# EAGLE design decoder (EAGLE 7.2.0)
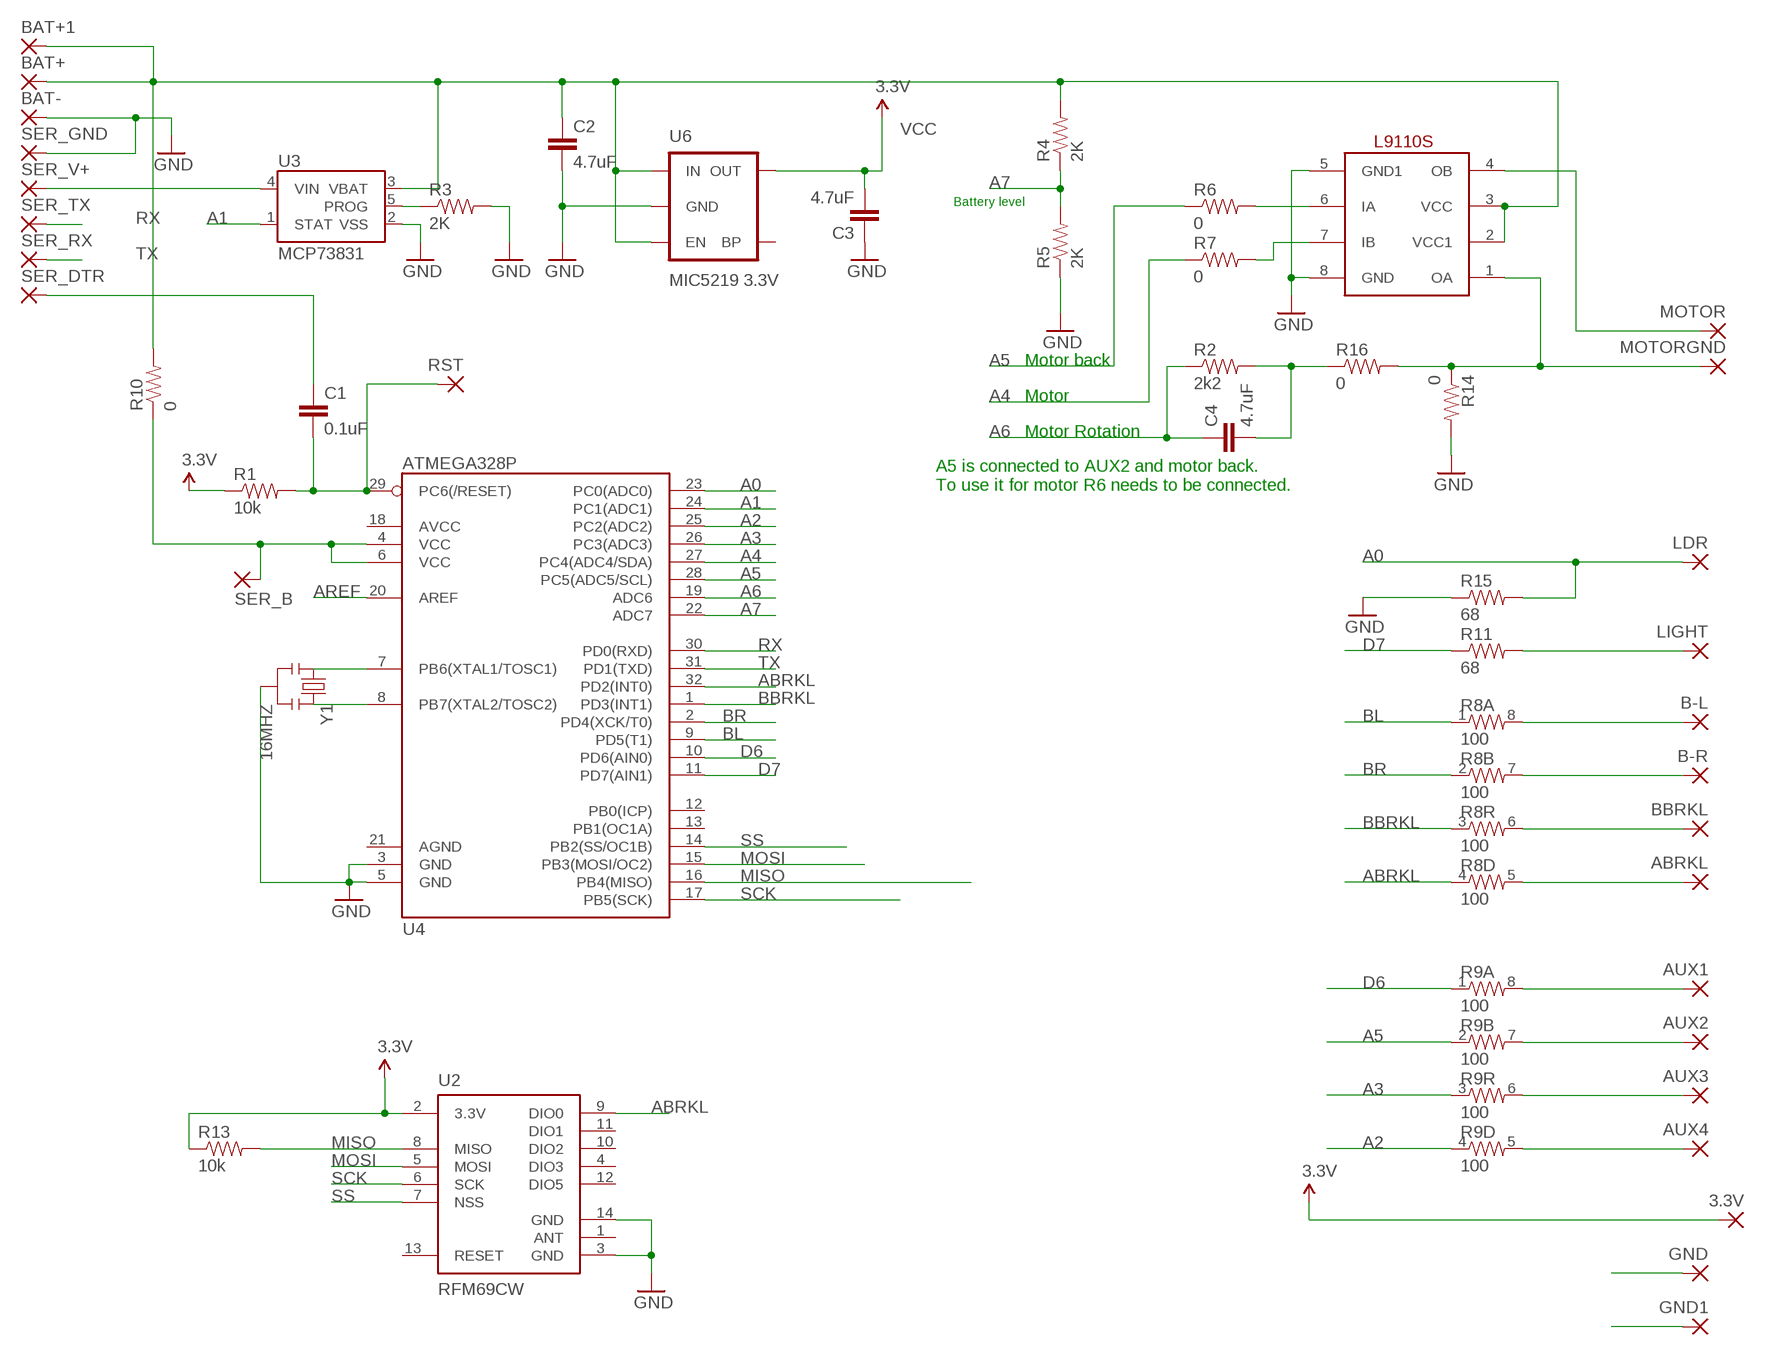
[diagram p0: schematic, sheet 1]

## Parts
3.3V  SMD2  [SMD1,27-2,54]
ABRKL  SMD2  [SMD1,27-2,54]
AUX1  SMD2  [SMD1,27-2,54]
AUX2  SMD2  [SMD1,27-2,54]
AUX3  SMD2  [SMD1,27-2,54]
AUX4  SMD2  [SMD1,27-2,54]
B-L  SMD2  [SMD1,27-2,54]
B-R  SMD2  [SMD1,27-2,54]
BAT+  SMD2  [SMD1,27-2,54]
BAT+1  SMD2  [SMD1,27-2,54]
BAT-  SMD2  [SMD1,27-2,54]
BBRKL  SMD2  [SMD1,27-2,54]
C1  0.1uF  CAP0805  [0805]
C2  4.7uF  CAP0805  [0805]
C3  4.7uF  CAP0805  [0805]
C4  4.7uF  CAP0805  [0805]
GND  SMD2  [SMD1,27-2,54]
GND1  SMD2  [SMD1,27-2,54]
LDR  SMD2  [SMD1,27-2,54]
LIGHT  SMD2  [SMD1,27-2,54]
MDRIVER  L9110S  [SO08]
MOTOR  SMD2  [SMD1,27-2,54]
MOTORGND  SMD2  [SMD1,27-2,54]
R1  10k  RESISTOR0603-RES  [0603-RES]
R2  2k2  RESISTOR0603-RES  [0603-RES]
R3  2K  RESISTOR0603-RES  [0603-RES]
R4  2K  RESISTOR0603-RES  [0603-RES]
R5  2K  RESISTOR0603-RES  [0603-RES]
R6  0  RESISTOR0603-RES  [0603-RES]
R7  0  RESISTOR0603-RES  [0603-RES]
R8  100  RESISTOR-ARRAY0603-ARV  [0603-ARV]
R9  100  RESISTOR-ARRAY0603-ARV  [0603-ARV]
R10  0  RESISTOR0603-RES  [0603-RES]
R11  68  RESISTOR0603-RES  [0603-RES]
R13  10k  RESISTOR0603-RES  [0603-RES]
R14  0  RESISTOR0603-RES  [0603-RES]
R15  68  RESISTOR0603-RES  [0603-RES]
R16  0  RESISTOR0603-RES  [0603-RES]
RST  SMD2  [SMD1,27-2,54]
SER_B  SMD2  [SMD1,27-2,54]
SER_DTR  SMD2  [SMD1,27-2,54]
SER_GND  SMD2  [SMD1,27-2,54]
SER_RX  SMD2  [SMD1,27-2,54]
SER_TX  SMD2  [SMD1,27-2,54]
SER_V+  SMD2  [SMD1,27-2,54]
U2  RFM69CW  [RFM69CW-XXXS2]
U3  MCP73831  [SOT23-5]
U4  ATMEGA328P  ATMEGA328_SMT  [TQFP32-08]
U6  MIC5219 3.3V  V_REG_MIC52193.3V  [SOT23-5]
Y1  16MHZ  RESONATOR16MHZ  [RESONATOR-SMD]

## Nets
A0: LDR.1(P) R15.2 U4.23(PC0(ADC0))
A1: U3.1(STAT) U4.24(PC1(ADC1))
A2: R9.4 U4.25(PC2(ADC2))
A3: R9.3 U4.26(PC3(ADC3))
A4: R7.1 U4.27(PC4(ADC4/SDA))
A5: R6.1 R9.2 U4.28(PC5(ADC5/SCL))
A6: C4.1 R2.1 U4.19(ADC6)
A7: R4.1 R5.2 U4.22(ADC7)
ABRKL: R8.4 U2.9(DIO0) U4.32(PD2(INT0))
AREF: U4.20(AREF)
BAT+: BAT+1.1(P) BAT+.1(P) C2.1 MDRIVER.2(VCC1) MDRIVER.3(VCC) R4.2 R10.2 U3.3(VBAT) U6.1(IN) U6.3(EN)
BBRKL: R8.3 U4.1(PD3(INT1))
BL: R8.1 U4.9(PD5(T1))
BR: R8.2 U4.2(PD4(XCK/T0))
D6: R9.1 U4.10(PD6(AIN0))
D7: R11.1 U4.11(PD7(AIN1))
GND: BAT-.1(P) C2.2 C3.1 GND1.1(P) GND.1(P) MDRIVER.5(GND1) MDRIVER.8(GND) R3.2 R5.1 R14.2 R15.1 SER_GND.1(P) U2.3(GND) U2.14(GND) U3.2(VSS) U4.3(GND) U4.5(GND) U6.2(GND) Y1.2
MISO: R13.2 U2.8(MISO) U4.16(PB4(MISO))
MOSI: U2.5(MOSI) U4.15(PB3(MOSI/OC2))
N$1: C4.2 R2.2 R16.1
N$2: U4.7(PB6(XTAL1/TOSC1)) Y1.1
N$3: C1.1 SER_DTR.1(P)
N$4: U4.8(PB7(XTAL2/TOSC2)) Y1.3
N$5: C1.2 R1.2 RST.1(P) U4.29(PC6(/RESET))
N$6: MDRIVER.6(IA) R6.2
N$7: MDRIVER.7(IB) R7.2
N$8: R10.1 SER_B.1(P) U4.4(VCC) U4.6(VCC)
N$9: SER_V+.1(P) U3.4(VIN)
N$11: R3.1 U3.5(PROG)
N$12: LIGHT.1(P) R11.2
N$13: B-L.1(P) R8.8
N$16: B-R.1(P) R8.7
N$18: BBRKL.1(P) R8.6
N$20: ABRKL.1(P) R8.5
N$21: AUX1.1(P) R9.8
N$22: AUX2.1(P) R9.7
N$23: AUX3.1(P) R9.6
N$24: AUX4.1(P) R9.5
OA: MDRIVER.1(OA) MOTORGND.1(P) R14.1 R16.2
OB: MDRIVER.4(OB) MOTOR.1(P)
RX: SER_TX.1(P) U4.30(PD0(RXD))
SCK: U2.6(SCK) U4.17(PB5(SCK))
SS: U2.7(NSS) U4.14(PB2(SS/OC1B))
TX: SER_RX.1(P) U4.31(PD1(TXD))
VCC: 3.3V.1(P) C3.2 R1.1 R13.1 U2.2(3.3V) U6.5(OUT) ; supply symbol labelled 3.3V
Unconnected: U2.1(ANT) U2.4(DIO3) U2.10(DIO2) U2.11(DIO1) U2.12(DIO5) U2.13(RESET) U4.12(PB0(ICP)) U4.13(PB1(OC1A)) U4.18(AVCC) U4.21(AGND) U6.4(BP)

## Notes on the sheet
- Battery level
- Motor back
- Motor
- Motor Rotation
- A5 is connected to AUX2 and motor back. 
  To use it for motor R6 needs to be connected.

## Library data of the parts
3.3V ABRKL AUX1-AUX4 B-L B-R BAT+ BAT+1 BAT- BBRKL GND GND1 LDR LIGHT MOTOR MOTORGND RST SER_B SER_DTR SER_GND SER_RX SER_TX SER_V+ = wirepad:SMD2: SMD PAD
C1-C4 = SparkFun-Capacitors:CAP: Capacitor Standard 0603 ceramic capacitor, and 0.1" leaded capacitor.
MDRIVER = h-bridge-l9119s:L9110S: H Bridge L9110s
R1-R7 R10 R11 R13-R16 = SparkFun-Resistors:RESISTOR: Resistor Basic schematic elements and footprints for 0603, 1206, and PTH resistors.
R8 R9 = SparkFun-Resistors:RESISTOR-ARRAY: Array Chip Resistor Source: RS Component / Phycomp
U2 = SparkFun-RF:RFM69
U3 = SparkFun-PowerIC:MCP73831: Miniature single cell, fully integrated Li-Ion, Li-polymer charge management controller http://ww1.microchip.com/downloads/en/DeviceDoc/21984a.pdf IC-09995; PROD_ID: IC-09995
U4 = SparkFun-DigitalIC:ATMEGA328_SMT: 32-Pin Atmega328 part Commonly used on Arduino compatible boards Available in QFP and QFN packages TQFP is IC-09069 QFN is non-stock; PROD_ID: IC-09069
U6 = SparkFun-PowerIC:V_REG_MIC5219: V_REG MIC5219 Standard 3.3V and 5V 500mA LDO voltage regulator in SOT-23 layout. Micrel part MIC5219. BP (by-pass) pin is used to lower output noise with 470pF cap, may be left open.; PROD_ID: VREG-09872
Y1 = SparkFun-FreqCtrl:RESONATOR: Resonator Small SMD resonator. Used, eg, on the Arduino Pro/ Pro Mini boards. 8MHz- XTAL-08895 16MHz- XTAL-08900; PROD_ID: XTAL-08900

## Board
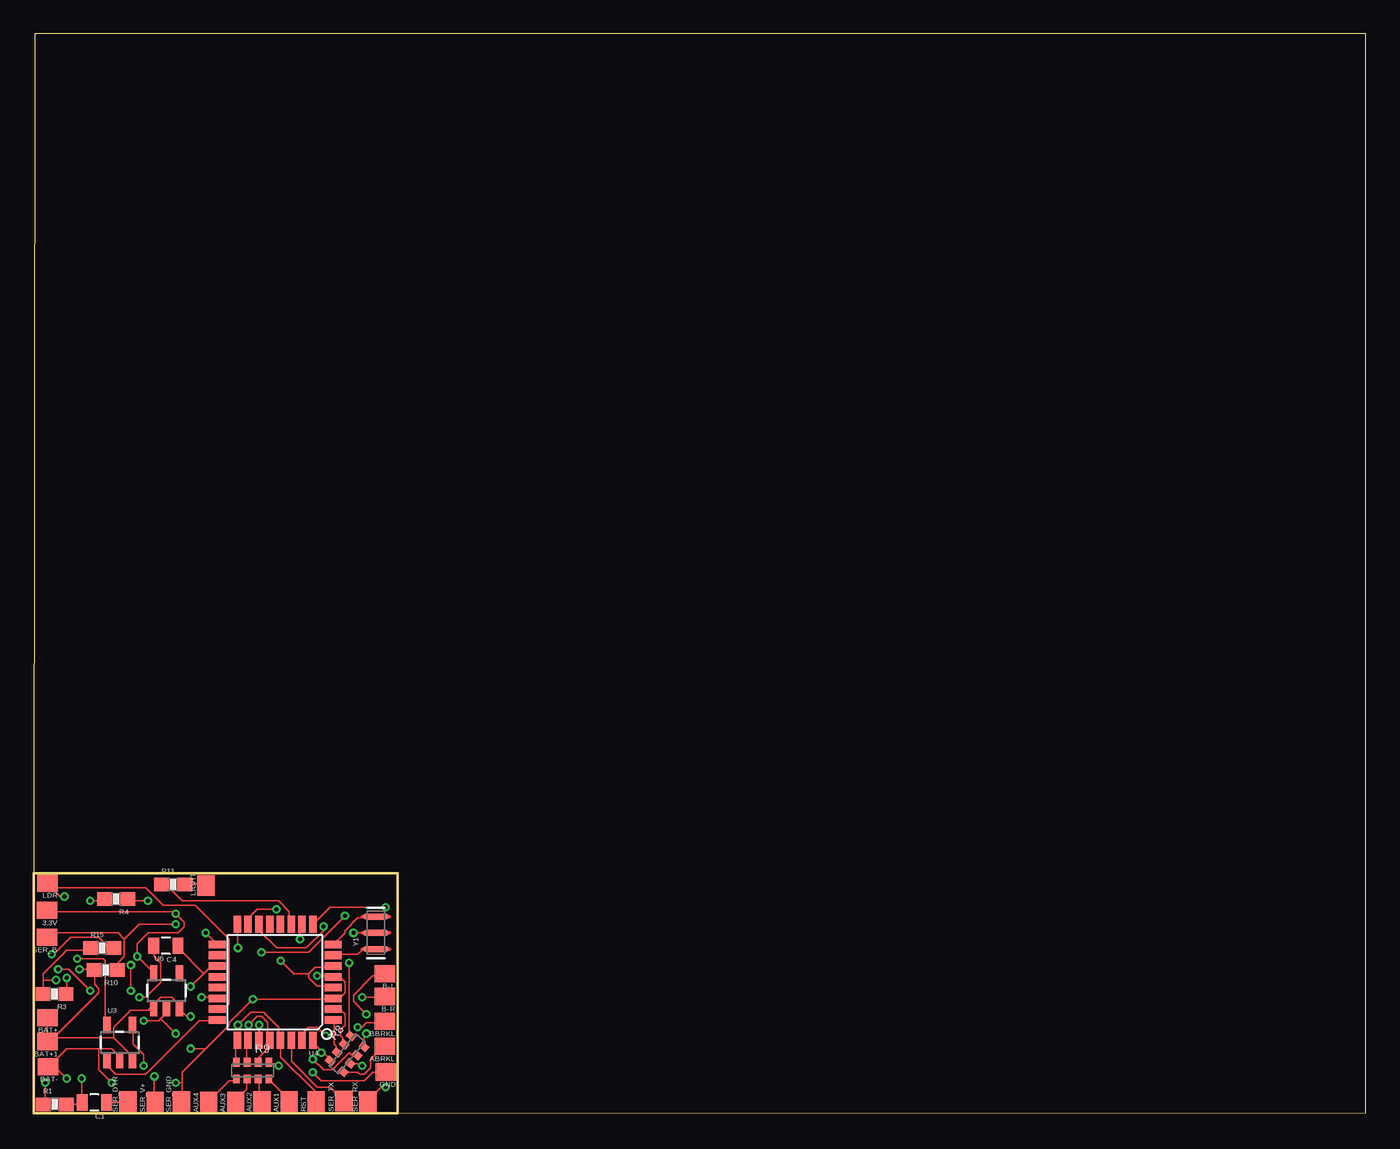
[diagram p1: board, top side]
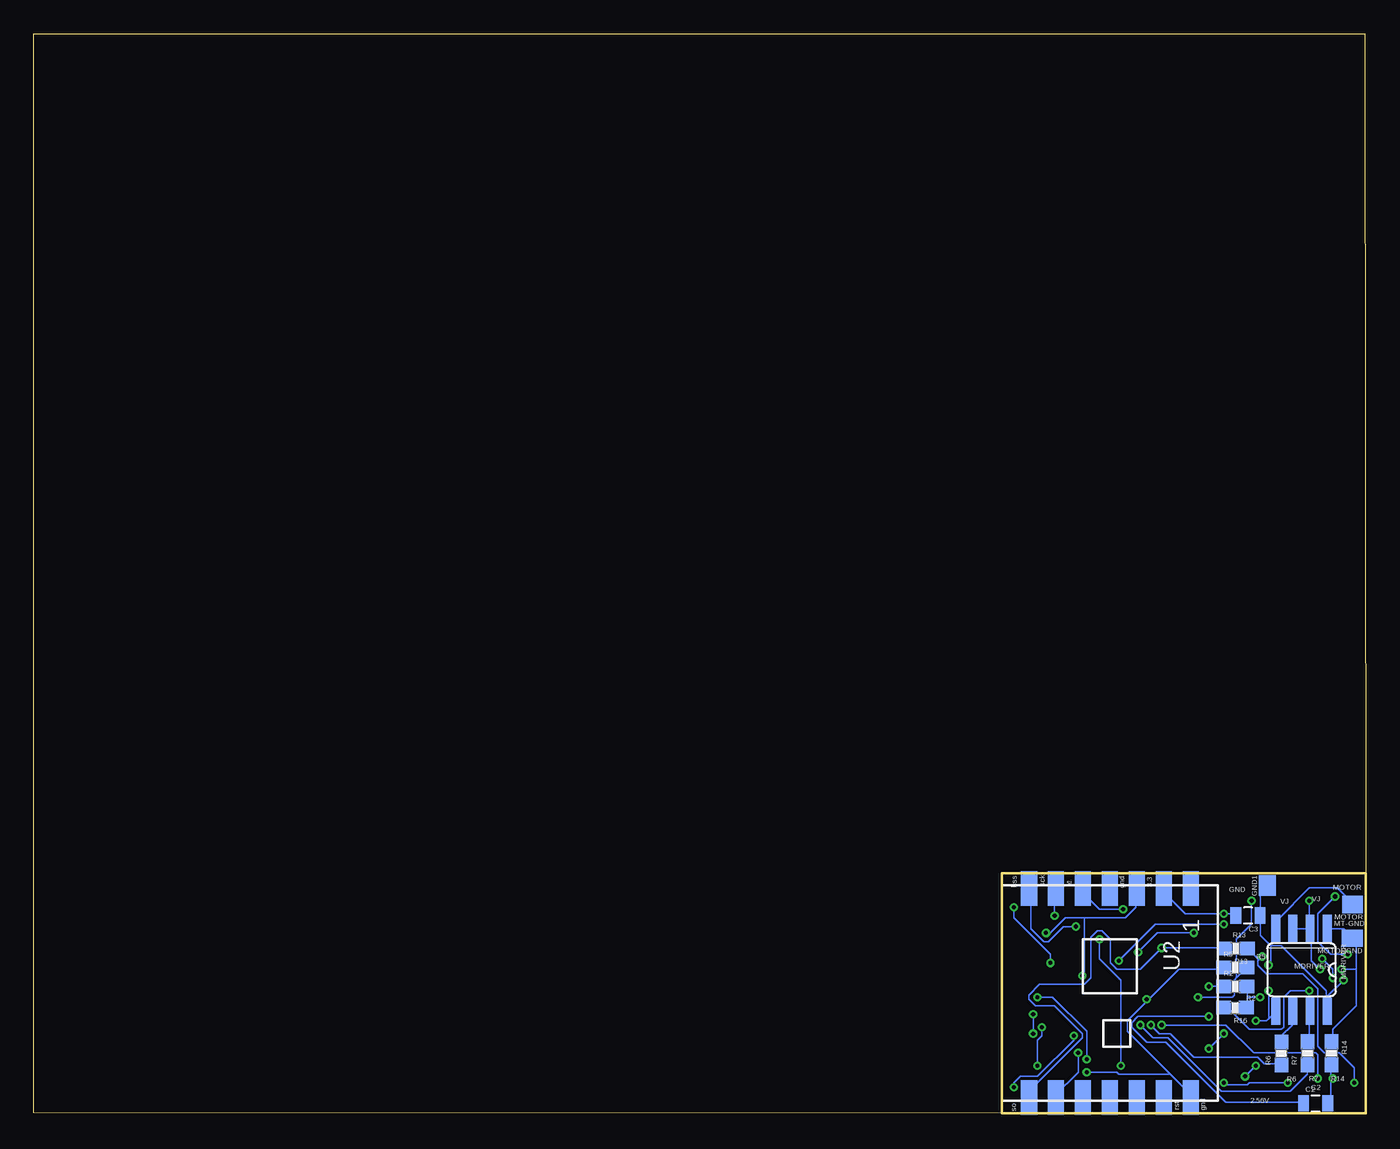
[diagram p2: board, bottom side, seen from below]

Size 98.79 x 80.04 mm. Coordinates in mm from the lower left corner, seen from the top.
Outline: 26.99,0 98.79,0.04 98.79,80.04 0.06,80.04 0.02,17.79
Outline: 0.02,17.79 26.98,17.8 26.99,0
Outline: 26.99,0 0,0.02 0.02,17.79
Copper layers (1*16): Top 0.035mm / dielectric 1.5mm / Bottom 0.035mm
Design rules "Elecrow_2-layer_eagle_rule *": minimum track width 5mil, minimum drill 12mil, track to track 6mil, track to pad 6mil, pad to pad 6mil, via to via 6mil, smd to smd 0mil, copper to edge 10mil, drill to drill 10mil, minimum pad ring 10mil, minimum via ring 6mil, stop-mask expansion 2mil, vias tented up to drill 100mil, thermal gap 10mil

### Footprints (pad centres in the part's own frame; a part is rotated, then mirrored left to right if it is on the bottom)
SMD1,27-2,54 = smd 1.27 x 1.524: 1 0,0
0805 = smd 0.8 x 1.2: 1 -0.9,0; 2 0.9,0
SO08 = smd 0.66 x 2.032: 1 -1.905,-3.073; 2 -0.635,-3.073; 3 0.635,-3.073; 4 1.905,-3.073; 5 1.905,3.073; 6 0.635,3.073; 7 -0.635,3.073; 8 -1.905,3.073
0603-RES = smd 1.1 x 1: 1 -0.85,0; 2 0.85,0
0603-ARV = smd 0.5 x 0.65: 1 -1.2,-0.625; 2 -0.4,-0.625; 3 0.4,-0.625; 4 1.2,-0.625; 5 1.2,0.625; 6 0.4,0.625; 7 -0.4,0.625; 8 -1.2,0.625
RFM69CW-XXXS2 = smd 2.543 x 1.2: 1 -7.754,6; 2 -7.754,4; 3 -7.754,2; 4 -7.754,0; 5 -7.754,-2; 6 -7.754,-4; 7 -7.754,-6; 8 7.754,-6; 9 7.754,-4; 10 7.754,-2; 11 7.754,0; 12 7.754,2; 13 7.754,4; 14 7.754,6
SOT23-5 = smd 0.55 x 1.2: 1 -0.95,-1.3; 2 0,-1.3; 3 0.95,-1.3; 4 0.95,1.3; 5 -0.95,1.3
TQFP32-08 = smd 1.27 x 0.559: 1 -4.293,2.8; 2 -4.293,2; 3 -4.293,1.2; 4 -4.293,0.4; 5 -4.293,-0.4; 6 -4.293,-1.2; 7 -4.293,-2; 8 -4.293,-2.8; 17 4.293,-2.8; 18 4.293,-2; 19 4.293,-1.2; 20 4.293,-0.4; 21 4.293,0.4; 22 4.293,1.2; 23 4.293,2; 24 4.293,2.8 | smd 0.559 x 1.27: 9 -2.8,-4.293; 10 -2,-4.293; 11 -1.2,-4.293; 12 -0.4,-4.293; 13 0.4,-4.293; 14 1.2,-4.293; 15 2,-4.293; 16 2.8,-4.293; 25 2.8,4.293; 26 2,4.293; 27 1.2,4.293; 28 0.4,4.293; 29 -0.4,4.293; 30 -1.2,4.293; 31 -2,4.293; 32 -2.8,4.293
RESONATOR-SMD = smd 0.45 x 1.905: 1 -1.2,0; 2 0,0; 3 1.2,0

### Placement (x,y rotation side)
3.3V  1,15.05 90 top
ABRKL  26.03,4.97 90 top
AUX1  18.93,0.87 0 top
AUX2  16.93,0.88 0 top
AUX3  14.97,0.85 0 top
AUX4  12.98,0.85 0 top
B-L  26.04,10.35 90 top
B-R  26.04,8.67 90 top
BAT+  1.03,7.1 90 top
BAT+1  1.02,5.33 90 top
BAT-  1.07,3.46 90 top
BBRKL  26.04,6.83 90 top
C1  4.5,0.8 180 top
C2  3.72,0.74 0 bottom
C3  8.74,14.67 180 bottom
C4  9.8,12.42 180 top
GND  26.1,3.06 90 top
GND1  7.31,16.88 0 bottom
LDR  1.01,17.08 90 top
LIGHT  12.77,16.89 0 top
MDRIVER  4.77,10.64 180 bottom
MOTOR  0.97,15.49 90 bottom
MOTORGND  1,12.97 90 bottom
R1  1.56,0.68 0 top
R2  9.67,9.4 0 bottom
R3  1.54,8.86 180 top
R4  6.12,15.88 180 top
R5  9.67,10.82 0 bottom
R6  6.26,4.44 90 bottom
R7  4.32,4.46 90 bottom
R8  23.24,4.42 230 top
R9  16.24,3.18 180 top
R10  5.33,10.64 180 top
R11  10.34,16.98 0 top
R13  9.65,12.23 180 bottom
R14  2.54,4.46 270 bottom
R15  5.09,12.26 0 top
R16  9.7,7.84 180 bottom
RST  20.95,0.88 0 top
SER_B  0.98,13.05 90 top
SER_DTR  6.99,0.88 0 top
SER_GND  10.96,0.86 0 top
SER_RX  24.78,0.89 0 top
SER_TX  23,0.9 0 top
SER_V+  9.02,0.85 0 top
U2  18.97,8.92 270 bottom
U3  6.38,5.25 0 top
U4  17.9,9.72 180 top
U6  9.85,9.1 0 top
Y1  25.37,13.38 90 top

### Tracks (layer width: path | path; a pad name or v marks a point on that pad's centre or on a via)
A0  (via drill 0.3)
  Top 0.127: v1.33,11.79 1.49,11.79 2.76,13.06 4.82,13.06 5.62,12.27 R15.2 | v2.28,16.08 1.97,16.08 1.33,16.71 | 1.33,16.71 1.01,17.03 LDR.1 1.33,16.71 | 1.33,16.71 8.32,16.71 9.59,15.44 11.97,15.44 14.51,12.9 14.51,8.14 14.19,7.82 13.71,7.82 U4.23
  Bottom 0.127: v1.33,11.79 2.6,11.79 3.55,12.74 3.55,14.81 v2.28,16.08
A1
  Top 0.127: U3.1 5.46,3.85 5.46,3.54 6.09,2.9 8.32,2.9 12.29,6.87 13.56,6.87 U4.24
A2
  Top 0.127: R9.4 14.98,3.85 14.98,5.28 U4.25
A3
  Top 0.127: R9.3 15.78,3.85 15.78,5.28 U4.26
A4  (via drill 0.3)
  Top 0.127: v16.73,6.55 16.73,5.44 U4.27
  Bottom 0.127: v16.73,6.55 15.78,5.6 14.67,5.6 10.7,1.63 5.62,1.63 4.35,2.9 4.35,3.54 R7.1
A5  (via drill 0.3)
  Top 0.127: R9.2 16.73,3.85 16.73,4.17 17.37,4.81 17.37,5.28 U4.28 17.37,5.44 17.37,6.71 16.89,7.19 16.57,7.19 v15.94,6.55
  Bottom 0.127: v15.94,6.55 15.3,5.92 14.51,5.92 12.76,4.17 8,4.17 7.52,3.69 6.41,3.69 R6.1
A6  (via drill 0.3)
  Top 0.127: 12.6,10.36 13.08,10.84 13.56,10.84 U4.19 | 12.6,10.36 v11.65,9.41 | 12.6,10.36 10.7,12.27 C4.1
  Bottom 0.127: v11.65,9.41 10.54,9.41 R2.1
A7  (via drill 0.3)
  Top 0.127: v12.44,8.61 13.56,8.61 U4.22 | v8.48,15.76 7.05,15.76 R4.1
  Bottom 0.127: 9.59,10.04 9.75,9.88 9.75,8.77 9.9,8.61 v12.44,8.61 | 9.59,10.04 8.95,10.68 R5.2 | v8.48,15.76 8.48,14.01 9.59,12.9 9.59,10.04
ABRKL  (via drill 0.3)
  Top 0.127: 21.33,4.65 20.7,5.28 U4.32 | 21.33,4.65 21.97,4.01 R8.4 | v21.33,4.49 21.33,4.65
  Bottom 0.127: v21.33,4.49 21.33,3.06 23.08,1.31 U2.9
BAT+  (via drill 0.3)
  Top 0.127: v11.65,7.19 11.33,7.19 10.86,7.66 U6.3 10.7,7.82 10.7,8.14 10.22,8.61 9.43,8.61 8.48,7.66 | v4.19,15.76 5.14,15.76 R4.2 | 1.49,5.6 1.17,5.28 BAT+1.1 | 1.49,5.6 4.82,8.93 4.82,9.25 4.51,9.57 4.51,10.52 R10.2 4.35,10.68 v3.4,10.68 | 5.94,5.6 7.21,4.33 7.21,4.01 U3.3 | 1.49,5.6 5.94,5.6 | 1.49,5.6 BAT+1.1 | 8.48,7.66 7.21,7.66 5.94,6.39 5.94,5.6 | 8.48,7.66 8.79,7.66 U6.1 | BAT+.1 1.01,7.03 1.01,5.44 BAT+1.1
  Bottom 0.127: v11.65,7.19 16.89,7.19 17.37,6.71 17.37,6.39 16.25,5.28 14.83,5.28 10.38,0.84 4.67,0.84 C2.1 | v4.19,15.76 4.19,13.85 MDRIVER.2 | MDRIVER.3 5.3,13.69 4.19,13.69 MDRIVER.2 | v3.4,10.68 4.03,11.31 4.03,13.69 MDRIVER.2
BBRKL
  Top 0.127: R8.3 22.45,4.65 22.45,4.96 22.29,5.12 22.29,6.87 U4.1
BL  (via drill 0.3)
  Top 0.127: v23.4,11.16 23.4,5.76 R8.1 | v26.1,15.28 21.97,15.28 20.86,14.17 U4.9
  Bottom 0.127: v23.4,11.16 23.4,11.79 26.1,14.49 v26.1,15.28
BR
  Top 0.127: R8.2 22.92,5.28 22.92,5.6 22.76,5.76 22.76,6.23 23.08,6.55 23.08,7.35 22.76,7.66 22.29,7.66 U4.2
D6  (via drill 0.3)
  Top 0.127: v18.16,3.54 18,3.69 17.52,3.69 R9.1 | v19.75,12.9 19.75,14.01 U4.10
  Bottom 0.127: v18.16,3.54 18.16,9.88 19.75,11.47 v19.75,12.9
D7
  Top 0.127: R11.1 9.59,16.87 9.9,16.87 11.02,15.76 18.16,15.76 18.95,14.96 18.95,14.17 U4.11
GND  (via drill 0.3)
  Top 0.127: v20.7,3.06 21.33,2.42 24.51,2.42 25.14,3.06 GND.1 | 0.7,9.88 0.7,10.36 2.44,12.11 4.19,12.11 R15.1 | 0.7,9.88 0.7,8.93 R3.2 | v1.65,9.88 0.7,9.88 | v23.72,13.38 24.35,13.38 | 4.82,4.81 2.44,4.81 1.33,3.69 | 4.82,4.81 5.78,4.81 6.25,4.33 6.25,4.01 U3.2 | 1.33,3.69 1.17,3.54 BAT-.1 1.33,3.69 | 1.33,3.69 v2.44,2.58 | 9.43,7.03 9.27,6.87 v8.16,6.87 | 9.43,7.03 9.75,7.35 9.75,7.66 U6.2 | 11.02,2.27 11.02,3.06 12.76,4.81 | 11.02,2.27 11.02,1 SER_GND.1 | 12.76,4.81 14.51,6.55 14.51,6.71 v16.25,8.46 22.13,8.46 U4.3 22.29,8.61 22.76,8.61 23.08,8.93 23.08,9.73 22.76,10.04 22.29,10.04 U4.5 22.13,10.2 v21.02,10.2 | v10.54,5.92 9.43,7.03 | 12.76,4.81 v11.65,4.81 | 4.82,4.81 4.82,3.22 v5.78,2.27 | 11.02,2.27 v10.54,2.27 | v7.21,9.09 v7.21,11
  Bottom 0.127: 16.1,8.46 17.68,6.87 17.68,6.07 14.51,2.9 | 16.1,8.46 13.87,10.68 10.54,10.68 R5.1 | 14.51,2.9 12.92,1.31 U2.14 | v20.7,3.06 18.48,3.06 18.32,2.9 14.51,2.9 | GND1.1 7.36,16.87 7.84,16.39 7.84,14.81 C3.1 7.84,14.65 7.84,13.22 7.05,12.43 | 2.92,8.61 2.92,9.09 6.25,12.43 7.05,12.43 | 2.92,8.61 2.92,7.66 MDRIVER.8 | 2.92,8.61 v1.65,9.88 | v23.72,13.38 23.4,13.38 22.29,14.49 20.86,14.49 | 20.86,14.49 17.84,14.49 17.05,15.28 17.05,16.55 U2.3 | 2.6,2.58 2.6,1 2.76,0.84 C2.2 | 2.6,2.58 2.6,3.54 R14.2 | v2.44,2.58 2.6,2.58 | v8.16,6.87 7.36,6.87 7.21,7.03 | 7.21,7.03 6.73,7.5 MDRIVER.5 | v11.65,4.81 v10.54,5.92 | v5.78,2.27 8.63,2.27 8.79,2.11 10.38,2.11 v10.54,2.27 | 20.86,14.49 20.86,10.36 v21.02,10.2 | 7.05,12.43 7.05,11.16 v7.21,11 | 7.21,7.03 v7.21,9.09 | v16.25,8.46 16.1,8.46
MISO  (via drill 0.3)
  Top 0.127: v15.14,12.27 15.14,14.01 U4.16
  Bottom 0.127: R13.2 10.54,12.27 v15.14,12.27 16.73,10.68 18.48,10.68 18.95,11.16 18.95,12.9 19.59,13.54 19.91,13.54 20.38,13.06 20.38,10.04 20.86,9.57 24.19,9.57 24.99,8.77 24.99,8.46 24.51,7.98 23.08,7.98 21.02,5.92 21.02,5.6 24.83,1.79 24.83,1.31 U2.8
MOSI  (via drill 0.3)
  Top 0.127: v18,15.12 16.57,15.12 15.94,14.49 15.94,14.17 U4.15
  Bottom 0.127: v18,15.12 19.75,15.12 20.86,16.23 20.86,16.55 U2.5
N$1  (via drill 0.3)
  Top 0.127: v7.84,8.61 8.32,8.61 9.43,9.73 9.43,11.16 8.95,11.63 8.95,12.27 C4.2
  Bottom 0.127: 8.79,8.61 8.79,9.25 R2.2 | 8.79,8.61 8.79,7.98 R16.1 | 8.79,8.61 v7.84,8.61
N$2
  Top 0.127: U4.7 22.29,11.79 24.03,11.79 24.35,12.11 24.35,12.18
N$3
  Top 0.127: C1.1 5.46,0.84 6.89,0.84 SER_DTR.1
N$4
  Top 0.127: U4.8 22.29,12.58 23.08,13.38 23.08,13.54 24.03,14.49 24.35,14.49 24.35,14.58
N$5  (via drill 0.3)
  Top 0.127: R1.2 2.44,0.68 3.55,0.68 C1.2 3.55,0.84 v3.55,2.58 | RST.1 20.86,1 20.86,1.63 18.32,4.17 18.32,5.28 U4.29 18.16,5.44 18.16,6.39 17.05,7.5 16.1,7.5 v15.14,6.55
  Bottom 0.127: v3.55,2.58 3.55,4.33 3.71,4.49 8.32,4.49 10.38,6.55 v15.14,6.55
N$6
  Bottom 0.127: R6.2 6.25,5.44 6.25,5.76 5.46,6.55 5.46,7.5 MDRIVER.6
N$7
  Bottom 0.127: R7.2 4.19,5.44 4.19,7.5 MDRIVER.7
N$8  (via drill 0.3)
  Top 0.127: 20.38,10.36 20.38,10.04 21.02,9.41 22.13,9.41 U4.4 | 20.38,10.36 20.86,10.84 22.13,10.84 U4.6 | 6.73,12.9 6.73,11.63 6.25,11.16 6.25,10.68 R10.1 | 6.73,12.9 6.25,13.38 1.33,13.38 1.01,13.06 SER_B.1 | 20.38,10.36 19.27,10.36 v18.32,11.31 | v10.54,14.01 7.84,14.01 6.73,12.9
  Bottom 0.127: v18.32,11.31 15.62,14.01 v10.54,14.01
N$9  (via drill 0.3)
  Top 0.127: v8.16,3.54 8.16,4.33 7.36,5.12 7.36,6.39 U3.4 | v8.95,2.74 8.95,1 SER_V+.1
  Bottom 0.127: v8.95,2.74 v8.16,3.54
N$11  (via drill 0.3)
  Top 0.127: v2.44,10.04 2.44,8.93 R3.1 | v3.24,11.47 5.14,11.47 5.3,11.31 5.3,6.55 U3.5
  Bottom 0.127: v2.44,10.04 2.44,10.68 v3.24,11.47
N$12
  Top 0.127: R11.2 11.33,17.03 12.76,17.03 LIGHT.1
N$13  (via drill 0.3)
  Top 0.127: v24.67,5.92 24.51,5.76 24.51,4.96 R8.8 | v24.67,7.35 23.72,8.3 23.72,8.77 25.14,10.2 25.94,10.2 B-L.1
  Bottom 0.127: v24.67,7.35 v24.67,5.92
N$16  (via drill 0.3)
  Top 0.127: v20.7,4.01 21.49,3.22 22.13,3.22 23.4,4.49 23.56,4.33 23.87,4.33 R8.7 | v24.35,8.61 25.94,8.61 B-R.1
  Bottom 0.127: v20.7,4.01 20.7,6.07 23.24,8.61 v24.35,8.61
N$18  (via drill 0.3)
  Top 0.127: v24.35,3.54 24.19,3.69 23.56,3.69 R8.6 | v24.03,6.39 24.35,6.39 24.67,6.71 25.94,6.71 BBRKL.1
  Bottom 0.127: v24.35,3.54 24.35,5.44 24.03,5.76 v24.03,6.39
N$20
  Top 0.127: R8.5 23.08,3.06 24.03,3.06 24.19,2.9 24.51,2.9 24.99,3.38 24.99,4.01 25.94,4.96 ABRKL.1
N$21
  Top 0.127: R9.8 17.52,2.42 18.95,1 AUX1.1
N$22
  Top 0.127: R9.7 16.73,2.42 16.73,1.15 16.89,1 AUX2.1
N$23
  Top 0.127: R9.6 15.78,2.42 15.78,1.79 14.98,1 AUX3.1
N$24
  Top 0.127: R9.5 14.98,2.42 14.51,2.42 13.08,1 AUX4.1
OA  (via drill 0.3)
  Top 0.127: v4.19,9.09 2.6,10.68 v1.81,10.68
  Bottom 0.127: 0.7,10.68 0.7,12.74 0.86,12.9 MOTORGND.1 1.01,13.06 1.65,13.69 2.76,13.69 MDRIVER.1 | 0.7,10.68 0.7,7.98 2.44,6.23 2.44,5.44 R14.1 | v4.19,9.09 5.62,9.09 6.09,8.61 6.09,6.39 6.25,6.23 8.63,6.23 10.22,7.82 10.54,7.82 R16.2 | 0.7,10.68 v1.81,10.68
OB
  Bottom 0.127: MOTOR.1 1.01,15.6 2.13,16.71 4.19,16.71 6.57,14.33 6.57,13.85 MDRIVER.4
RX
  Top 0.127: U4.30 19.11,5.28 19.11,3.85 21.02,1.95 21.97,1.95 22.92,1 SER_TX.1
SCK  (via drill 0.3)
  Top 0.127: v12.76,13.38 13.56,12.58 U4.17 | v16.89,11.95 20.38,11.95 v23.08,14.65
  Bottom 0.127: v12.76,13.38 15.46,13.38 v16.89,11.95 | v23.08,14.65 23.08,16.55 U2.6
SS  (via drill 0.3)
  Top 0.127: v21.49,13.85 21.49,13.54 20.22,12.27 18,12.27 16.73,13.54 16.73,14.01 U4.14
  Bottom 0.127: v21.49,13.85 22.45,13.85 23.56,12.74 23.87,12.74 24.83,13.69 24.83,16.55 U2.7
TX  (via drill 0.3)
  Top 0.127: v21.65,5.76 21.02,6.39 20.38,6.39 19.91,5.92 U4.31 | v26.1,1.95 25.78,1.95 24.83,1 SER_RX.1
  Bottom 0.127: v21.65,5.76 21.65,5.44 24.35,2.74 25.62,2.74 26.1,2.27 v26.1,1.95
VCC  (via drill 0.3)
  Top 0.127: v0.86,2.27 0.86,0.68 R1.1 | U6.5 8.79,10.52 v7.68,11.63 7.68,12.58 8.48,13.38 10.7,13.38 11.17,13.85 11.17,14.17 v10.54,14.81 10.38,14.96 1.01,14.96 3.3V.1
  Bottom 0.127: C3.2 9.75,14.81 v10.54,14.81 13.4,14.81 14.83,16.23 14.83,16.55 U2.2 | v0.86,2.27 0.86,3.38 1.97,4.49 3.08,4.49 3.55,4.96 3.55,9.25 4.67,10.36 7.36,10.36 8,11 8,11.31 | 8,11.31 8,11.47 8.79,12.27 R13.1 | 8,11.31 v7.68,11.63

### Text on the board
_tsilk: RCCAR-V1.1 | RCCAR-V1.1 | R11 | LIGHT | LDR | R4 | C4 | 3.3V | R15 | R10 | B-L | R3 | R12 | B-R | U6 | BAT+ | R9 | BBRKL | BAT+ | U3 | ABRKL | BAT- | GND | C1 | DTR | SV+ | GND | AUX4 | AUX3 | AUX2 | AUX1 | RST | TX | RX | R1
_bsilk: 3.3 | gnd | si | sck | hss | MOTOR | VJ | GND | VJ | MT-GND | R13 | MDRIVER | R5 | R2 | R14 | C2 | R7 | R6 | 2.56V | so | gnd | rst